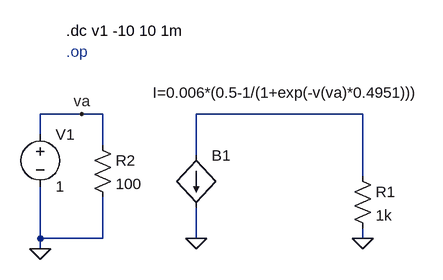
[diagram p0: schematic Behavioral2.asc]
Behavioral2.asc, the LTspice schematic file:
Version 4
SHEET 1 880 680
WIRE 64 48 0 48
WIRE 96 48 64 48
WIRE 496 48 240 48
WIRE 0 80 0 48
WIRE 96 96 96 48
WIRE 240 112 240 48
WIRE 496 144 496 48
WIRE 0 240 0 160
WIRE 96 240 96 176
WIRE 96 240 0 240
WIRE 240 240 240 192
WIRE 496 240 496 224
WIRE 0 256 0 240
FLAG 240 240 0
FLAG 496 240 0
FLAG 0 256 0
FLAG 64 48 va
SYMBOL bi 240 112 R0
WINDOW 3 -67 -97 Left 2
SYMATTR Value I=0.006*(0.5-1/(1+exp(-v(va)*0.4951)))
SYMATTR InstName B1
SYMBOL res 480 128 R0
SYMATTR InstName R1
SYMATTR Value 1k
SYMBOL voltage 0 64 R0
WINDOW 123 0 0 Left 0
WINDOW 39 0 0 Left 0
SYMATTR InstName V1
SYMATTR Value 1
SYMBOL res 80 80 R0
SYMATTR InstName R2
SYMATTR Value 100
TEXT 40 -48 Left 2 ;.op
TEXT 40 -80 Left 2 !.dc v1 -10 10 1m

The netlist it stands for:
* Behavioral2.asc
B1 N001 0 I=0.006*(0.5-1/(1+exp(-v(va)*0.4951)))
R1 N001 0 1k
V1 va 0 1
R2 va 0 100
* .op
.dc v1 -10 10 1m
.backanno
.end